# Altium schematic sheet Main.SchDoc: Smart Bus Ticketing Machine
size A4; Date: 3/10/2025; ApprovedBy: Kiran Gunathilaka; CheckedBy: Kiran Gunathilaka; Author: Kiran Gunathilaka; DrawnBy: Kiran Gunathilaka; DocumentNumber: 01; Revision: v1.0; SheetNumber: 1; SheetTotal: 11
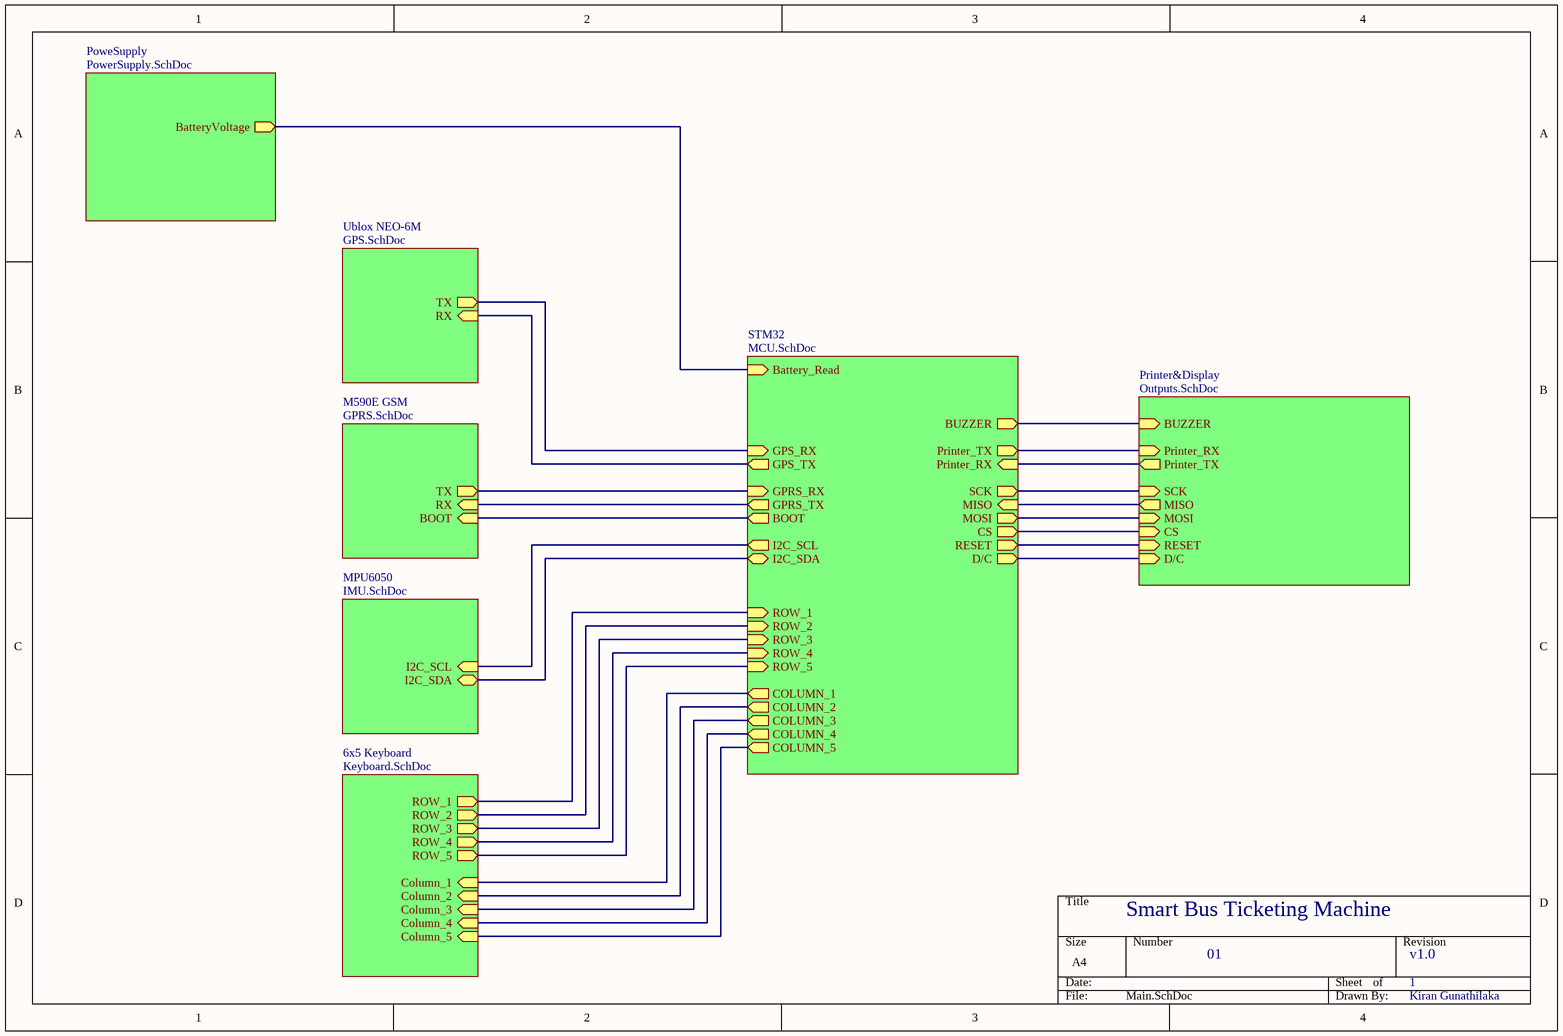
[diagram p0: Main.SchDoc]

## Sub-sheets
6x5 Keyboard = Keyboard.SchDoc: ROW_1 (out), ROW_2 (out), ROW_3 (out), ROW_4 (out), ROW_5 (out), Column_1 (in), Column_2 (in), Column_3 (in), Column_4 (in), Column_5 (in)
M590E GSM = GPRS.SchDoc: RX (in), TX (out), BOOT (in)
MPU6050 = IMU.SchDoc: I2C_SCL (in), I2C_SDA (bidir)
PoweSupply = PowerSupply.SchDoc: BatteryVoltage (out)
Printer&Display = Outputs.SchDoc: BUZZER (in), Printer_TX (out), Printer_RX (in), SCK (in), MISO (out), MOSI (in), CS (in), RESET (in), D/C (in)
STM32 = MCU.SchDoc: Printer_TX (out), Printer_RX (in), GPS_RX (in), GPS_TX (out), GPRS_RX (in), GPRS_TX (out), BUZZER (out), Battery_Read (in), ROW_1 (in), ROW_2 (in), ROW_3 (in), ROW_4 (in), ROW_5 (in), SCK (out), MISO (in), MOSI (out), COLUMN_1 (out), COLUMN_2 (out), COLUMN_3 (out), COLUMN_4 (out), COLUMN_5 (out), CS (out), I2C_SCL (out), I2C_SDA (bidir), RESET (out), D/C (out), BOOT (out)
Ublox NEO-6M = GPS.SchDoc: RX (in), TX (out)

## Nets
(unnamed): sheet STM32/Printer_TX, sheet Printer&Display/Printer_RX
(unnamed): sheet STM32/Printer_RX, sheet Printer&Display/Printer_TX
(unnamed): sheet STM32/GPS_RX, sheet Ublox NEO-6M/TX
(unnamed): sheet STM32/GPS_TX, sheet Ublox NEO-6M/RX
(unnamed): sheet STM32/GPRS_RX, sheet M590E GSM/TX
(unnamed): sheet STM32/GPRS_TX, sheet M590E GSM/RX
(unnamed): sheet STM32/BUZZER, sheet Printer&Display/BUZZER
(unnamed): sheet STM32/Battery_Read, sheet PoweSupply/BatteryVoltage
(unnamed): sheet STM32/ROW_1, sheet 6x5 Keyboard/ROW_1
(unnamed): sheet STM32/ROW_2, sheet 6x5 Keyboard/ROW_2
(unnamed): sheet STM32/ROW_3, sheet 6x5 Keyboard/ROW_3
(unnamed): sheet STM32/ROW_4, sheet 6x5 Keyboard/ROW_4
(unnamed): sheet STM32/ROW_5, sheet 6x5 Keyboard/ROW_5
(unnamed): sheet STM32/SCK, sheet Printer&Display/SCK
(unnamed): sheet STM32/MISO, sheet Printer&Display/MISO
(unnamed): sheet STM32/MOSI, sheet Printer&Display/MOSI
(unnamed): sheet STM32/COLUMN_1, sheet 6x5 Keyboard/Column_1
(unnamed): sheet STM32/COLUMN_2, sheet 6x5 Keyboard/Column_2
(unnamed): sheet STM32/COLUMN_3, sheet 6x5 Keyboard/Column_3
(unnamed): sheet STM32/COLUMN_4, sheet 6x5 Keyboard/Column_4
(unnamed): sheet STM32/COLUMN_5, sheet 6x5 Keyboard/Column_5
(unnamed): sheet STM32/CS, sheet Printer&Display/CS
(unnamed): sheet STM32/I2C_SCL, sheet MPU6050/I2C_SCL
(unnamed): sheet STM32/I2C_SDA, sheet MPU6050/I2C_SDA
(unnamed): sheet STM32/RESET, sheet Printer&Display/RESET
(unnamed): sheet STM32/D/C, sheet Printer&Display/D/C
(unnamed): sheet STM32/BOOT, sheet M590E GSM/BOOT